# Altium project UCL-MB-802154RT-2.PrjPcb
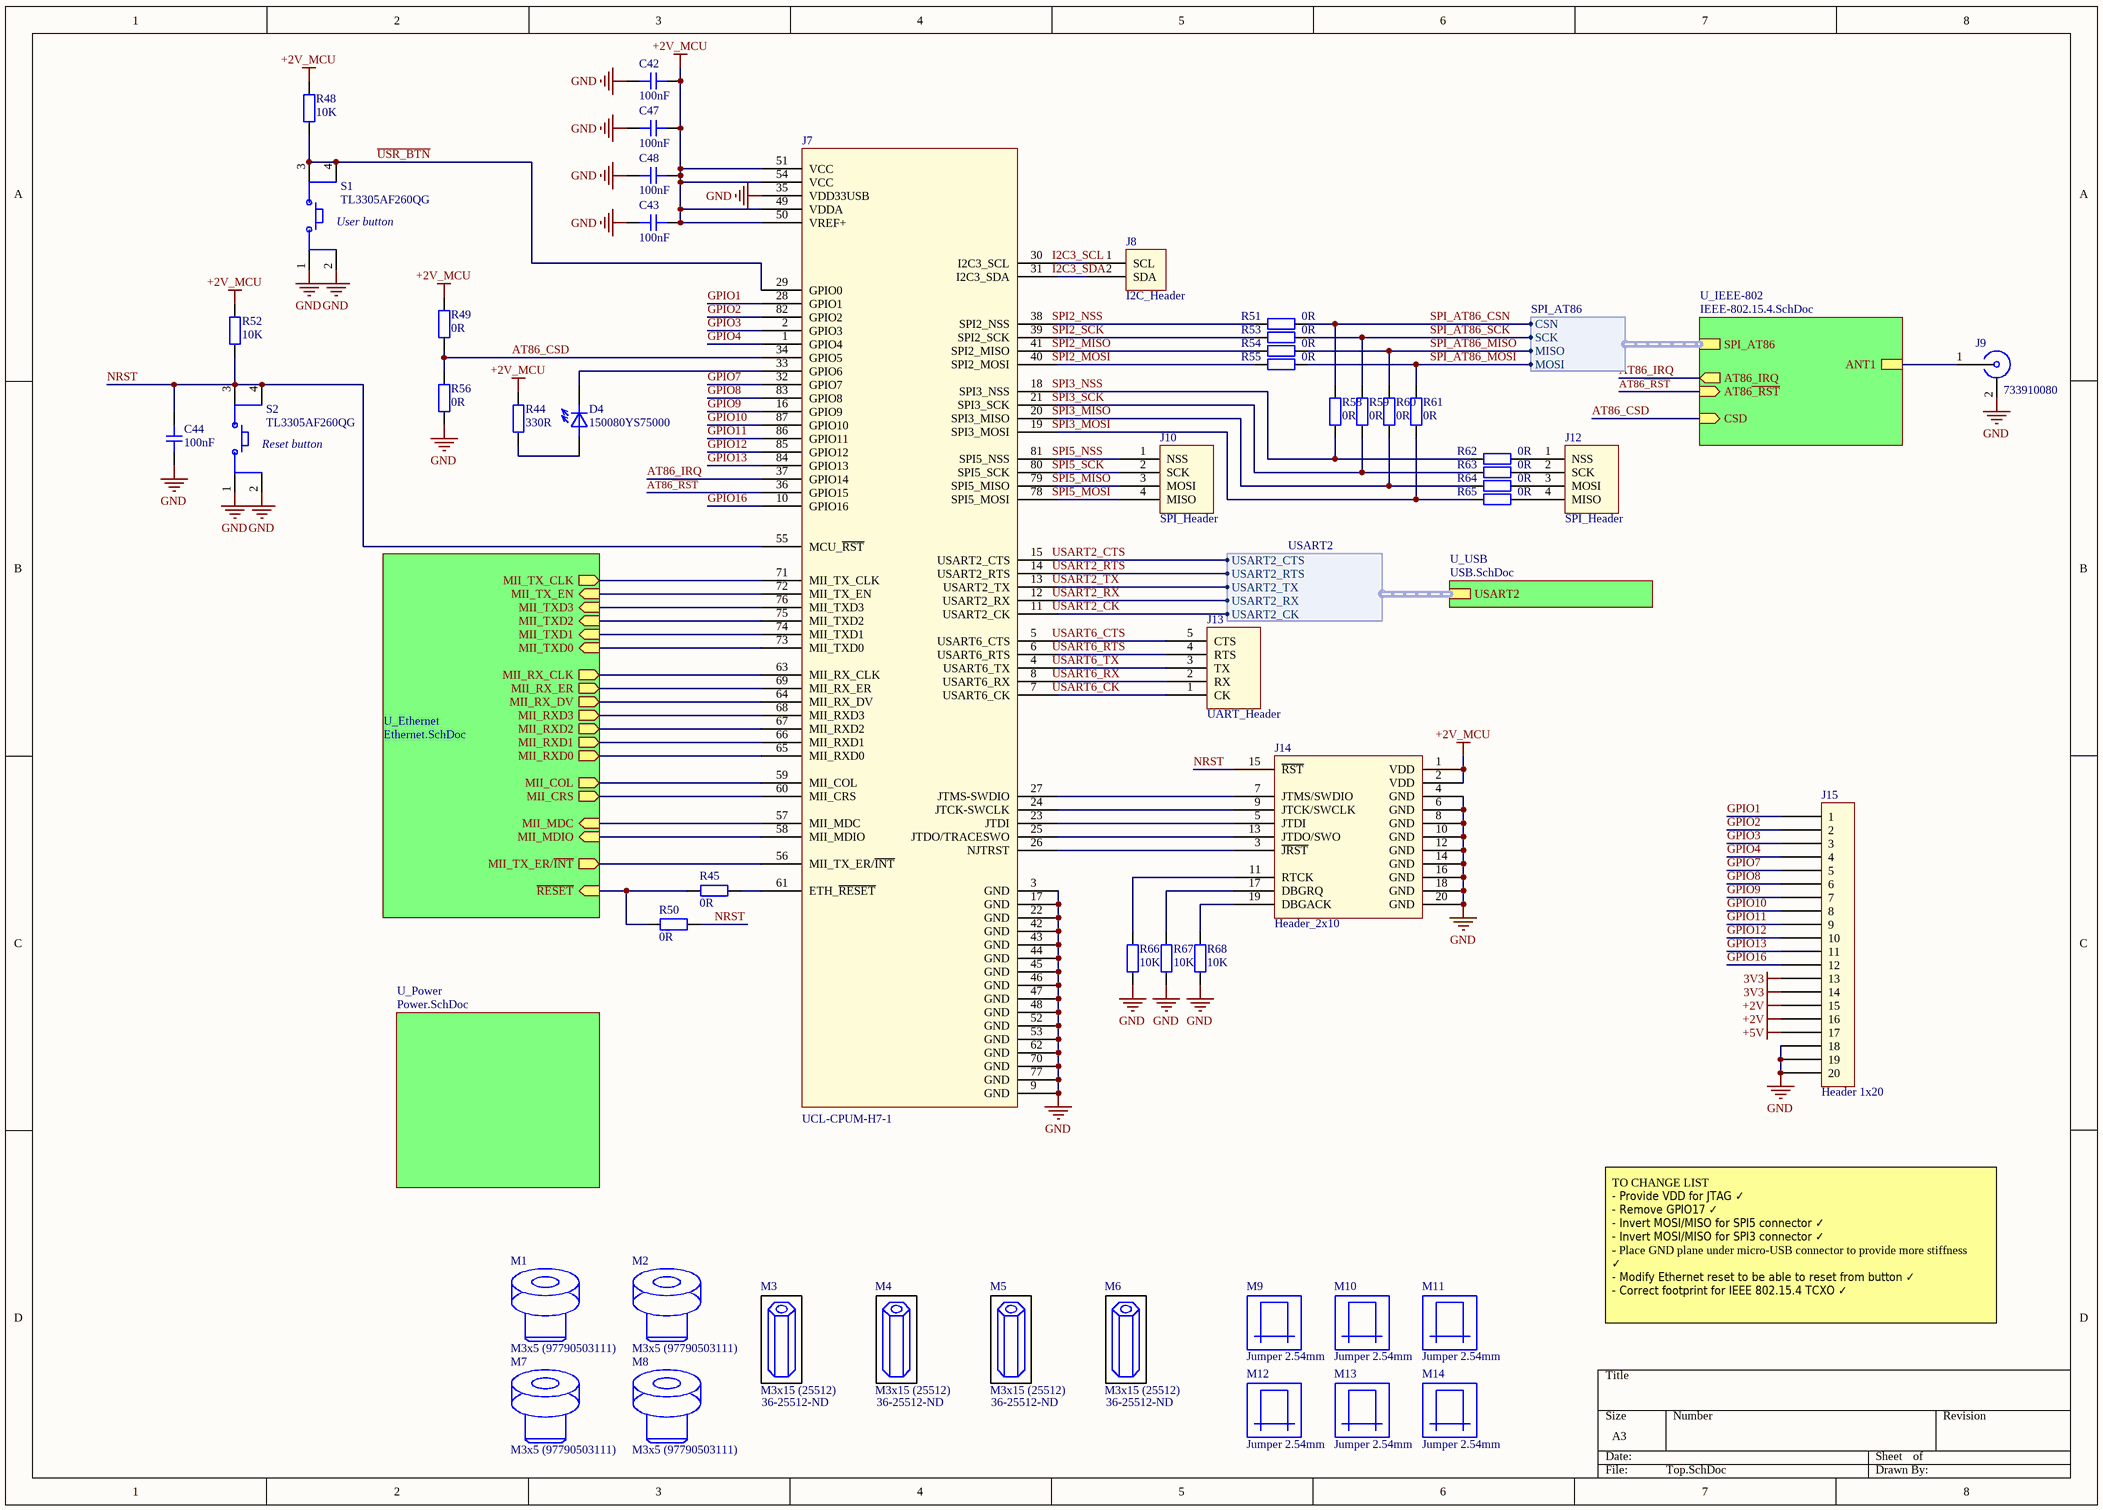
[diagram p0: Top.SchDoc]
5 sheets, 172 parts. Net scope: hierarchical (ports join the sheet entries above them; power ports are global).
Board file: UCL-MB-802154RT-2.PcbDoc
Sheets:
  Top.SchDoc
    U_Ethernet = Ethernet.SchDoc
    U_USB = USB.SchDoc
    U_Power = Power.SchDoc
    U_IEEE-802 = IEEE-802.15.4.SchDoc

## Sheet Top.SchDoc
size A3

### Parts
C42  value 100nF  [Capacitor-0603]  (hidden comment: C-100nF-0603)
C43  value 100nF  [Capacitor-0603]  (hidden comment: C-100nF-0603)
C44  value 100nF  [Capacitor-0603]  (hidden comment: C-100nF-0603)
C47  value 100nF  [Capacitor-0603]  (hidden comment: C-100nF-0603)
C48  value 100nF  [Capacitor-0603]  (hidden comment: C-100nF-0603)
D4  150080YS75000  [150080YS75000]
J7  UCL-CPUM-H7-1  [UCL-CPUM-H7-1]
J8  I2C_Header  [I2C_header]
J9  733910080  [SMA_733910080]
J10  SPI_Header  [SPI_Header]
J12  SPI_Header  [SPI_Header]
J13  UART_Header  [UART_Header]
J14  Header_2x10  [JTAG_Header]
J15  Header 1x20  [GPIO_Header]
M1  M3x5 (97790503111)  [Screw_M3]
M2  M3x5 (97790503111)  [Screw_M3]
M3  M3x15 (25512)  Supplier Part Number 1: 36-25512-ND
M4  M3x15 (25512)  Supplier Part Number 1: 36-25512-ND
M5  M3x15 (25512)  Supplier Part Number 1: 36-25512-ND
M6  M3x15 (25512)  Supplier Part Number 1: 36-25512-ND
M7  M3x5 (97790503111)  [Screw_M3]
M8  M3x5 (97790503111)  [Screw_M3]
M9  Jumper 2.54mm
M10  Jumper 2.54mm
M11  Jumper 2.54mm
M12  Jumper 2.54mm
M13  Jumper 2.54mm
M14  Jumper 2.54mm
R44  value 330R  [Resistor-0603]  (hidden comment: R-330R-0603)
R45  value 0R  [Resistor-0603]  (hidden comment: R-0R-0603)
R48  value 10K  [Resistor-0603]  (hidden comment: R-10K-0603)
R49  value 0R  [Resistor-0603]  (hidden comment: R-0R-0603)
R50  value 0R  [Resistor-0603]  (hidden comment: R-0R-0603)
R51  value 0R  [Resistor-0603]  (hidden comment: R-0R-0603)
R52  value 10K  [Resistor-0603]  (hidden comment: R-10K-0603)
R53  value 0R  [Resistor-0603]  (hidden comment: R-0R-0603)
R54  value 0R  [Resistor-0603]  (hidden comment: R-0R-0603)
R55  value 0R  [Resistor-0603]  (hidden comment: R-0R-0603)
R56  value 0R  [Resistor-0603]  (hidden comment: R-0R-0603)
R58  value 0R  [Resistor-0603]  (hidden comment: R-0R-0603)
R59  value 0R  [Resistor-0603]  (hidden comment: R-0R-0603)
R60  value 0R  [Resistor-0603]  (hidden comment: R-0R-0603)
R61  value 0R  [Resistor-0603]  (hidden comment: R-0R-0603)
R62  value 0R  [Resistor-0603]  (hidden comment: R-0R-0603)
R63  value 0R  [Resistor-0603]  (hidden comment: R-0R-0603)
R64  value 0R  [Resistor-0603]  (hidden comment: R-0R-0603)
R65  value 0R  [Resistor-0603]  (hidden comment: R-0R-0603)
R66  value 10K  [Resistor-0603]  (hidden comment: R-10K-0603)
R67  value 10K  [Resistor-0603]  (hidden comment: R-10K-0603)
R68  value 10K  [Resistor-0603]  (hidden comment: R-10K-0603)
S1  TL3305AF260QG  [TL3305AF260QG]
S2  TL3305AF260QG  [TL3305AF260QG]

### Sub-sheets
U_Ethernet = Ethernet.SchDoc: MII_RX_CLK (out), MII_RXD3 (out), MII_RXD2 (out), MII_RXD1 (out), MII_RXD0 (out), MII_RX_DV (out), MII_RX_ER (out), MII_TX_CLK (out), MII_TX_EN (in), MII_TXD0 (in), MII_TXD1 (in), MII_TXD2 (in), MII_TXD3 (in), MII_TX_ER/~{INT} (out), MII_MDIO (in), MII_MDC (in), MII_CRS (out), MII_COL (out), ~{RESET} (in)
U_IEEE-802 = IEEE-802.15.4.SchDoc: AT86_IRQ (out), AT86~{_RST} (in), SPI_AT86 (harness SPI_AT86), ANT1, CSD (in)
U_Power = Power.SchDoc: no entries
U_USB = USB.SchDoc: USART2 (harness USART2)

### Harnesses
USART2: USART2_CTS, USART2_RTS, USART2_TX, USART2_RX, USART2_CK
SPI_AT86: CSN, SCK, MISO, MOSI

### Nets
3V3: J15.13 J15.14
+2V: J15.15 J15.16
+2V_MCU: C42.2 C43.2 C47.2 C48.2 J7.49(VDDA) J7.50(VREF+) J7.51(VCC) J7.54(VCC) J14.1(VDD) J14.2(VDD) R44.2 R48.2 R49.2 R52.2
+5V: J15.17
GND: C42.1 C43.1 C44.1 C47.1 C48.1 J7.3(GND) J7.9(GND) J7.17(GND) J7.22(GND) J7.35(VDD33USB) J7.42(GND) J7.43(GND) J7.44(GND) J7.45(GND) J7.46(GND) J7.47(GND) J7.48(GND) J7.52(GND) J7.53(GND) J7.62(GND) J7.70(GND) J7.77(GND) J9.2(GND) J14.4(GND) J14.6(GND) J14.8(GND) J14.10(GND) J14.12(GND) J14.14(GND) J14.16(GND) J14.18(GND) J14.20(GND) J15.18 J15.19 J15.20 R56.1 R66.1 R67.1 R68.1 S1.1 S1.2 S2.1 S2.2
AT86~{_RST}: J7.36(GPIO15) ; sheet U_IEEE-802/AT86~{_RST}
AT86_CSD: J7.34(GPIO5) R49.1 R56.2 ; sheet U_IEEE-802/CSD
AT86_IRQ: J7.37(GPIO14) ; sheet U_IEEE-802/AT86_IRQ
ETH_MDC: J7.57(MII_MDC) ; sheet U_Ethernet/MII_MDC
ETH_MDIO: J7.58(MII_MDIO) ; sheet U_Ethernet/MII_MDIO
ETH_MII_ RX_ER: J7.69(MII_RX_ER) ; sheet U_Ethernet/MII_RX_ER
ETH_MII_COL: J7.59(MII_COL) ; sheet U_Ethernet/MII_COL
ETH_MII_CRS: J7.60(MII_CRS) ; sheet U_Ethernet/MII_CRS
ETH_MII_RX_CLK: J7.63(MII_RX_CLK) ; sheet U_Ethernet/MII_RX_CLK
ETH_MII_RX_DV: J7.64(MII_RX_DV) ; sheet U_Ethernet/MII_RX_DV
ETH_MII_RXD0: J7.65(MII_RXD0) ; sheet U_Ethernet/MII_RXD0
ETH_MII_RXD1: J7.66(MII_RXD1) ; sheet U_Ethernet/MII_RXD1
ETH_MII_RXD2: J7.67(MII_RXD2) ; sheet U_Ethernet/MII_RXD2
ETH_MII_RXD3: J7.68(MII_RXD3) ; sheet U_Ethernet/MII_RXD3
ETH_MII_TX_CLK: J7.71(MII_TX_CLK) ; sheet U_Ethernet/MII_TX_CLK
ETH_MII_TX_EN: J7.72(MII_TX_EN) ; sheet U_Ethernet/MII_TX_EN
ETH_MII_TX_ER/~{INT}: J7.56(MII_TX_ER/~{INT}) ; sheet U_Ethernet/MII_TX_ER/~{INT}
ETH_MII_TXD0: J7.73(MII_TXD0) ; sheet U_Ethernet/MII_TXD0
ETH_MII_TXD1: J7.74(MII_TXD1) ; sheet U_Ethernet/MII_TXD1
ETH_MII_TXD2: J7.75(MII_TXD2) ; sheet U_Ethernet/MII_TXD2
ETH_MII_TXD3: J7.76(MII_TXD3) ; sheet U_Ethernet/MII_TXD3
ETH_~{RESET}: R45.1 R50.1 ; sheet U_Ethernet/~{RESET}
GPIO1: J7.28(GPIO1) J15.1
GPIO2: J7.82(GPIO2) J15.2
GPIO3: J7.2(GPIO3) J15.3
GPIO4: J7.1(GPIO4) J15.4
GPIO7: J7.32(GPIO7) J15.5
GPIO8: J7.83(GPIO8) J15.6
GPIO9: J7.16(GPIO9) J15.7
GPIO10: J7.87(GPIO10) J15.8
GPIO11: J7.86(GPIO11) J15.9
GPIO12: J7.85(GPIO12) J15.10
GPIO13: J7.84(GPIO13) J15.11
GPIO16: J7.10(GPIO16) J15.12
NRST: C44.2 J7.55(MCU_~{RST}) J14.15(~{RST}) R50.2 R52.1 S2.3 S2.4
RF50_9: J9.1(SIG) ; sheet U_IEEE-802/ANT1
SPI_AT86_CSN: R51.2 R58.2 ; sheet U_IEEE-802/SPI_AT86.CSN
SPI_AT86_MISO: R54.2 R60.2 ; sheet U_IEEE-802/SPI_AT86.MISO
SPI_AT86_MOSI: R55.2 R61.2 ; sheet U_IEEE-802/SPI_AT86.MOSI
SPI_AT86_SCK: R53.2 R59.2 ; sheet U_IEEE-802/SPI_AT86.SCK
~{USR_BTN}: J7.29(GPIO0) R48.1 S1.3 S1.4
USART2_ RX: J7.12(USART2_RX) ; sheet U_USB/USART2.USART2_RX
USART2_ TX: J7.13(USART2_TX) ; sheet U_USB/USART2.USART2_TX
NetD4_1: D4.1 J7.33(GPIO6)
NetD4_2: D4.2 R44.1
NetJ7_4: J7.4(USART6_TX) J13.3(TX)
NetJ7_5: J7.5(USART6_CTS) J13.5(CTS)
NetJ7_6: J7.6(USART6_RTS) J13.4(RTS)
NetJ7_7: J7.7(USART6_CK) J13.1(CK)
NetJ7_8: J7.8(USART6_RX) J13.2(RX)
NetJ7_11: J7.11(USART2_CK) ; sheet U_USB/USART2.USART2_CK
NetJ7_14: J7.14(USART2_RTS) ; sheet U_USB/USART2.USART2_RTS
NetJ7_15: J7.15(USART2_CTS) ; sheet U_USB/USART2.USART2_CTS
NetJ7_18: J7.18(SPI3_NSS) R58.1 R62.1
NetJ7_19: J7.19(SPI3_MOSI) R61.1 R65.1
NetJ7_20: J7.20(SPI3_MISO) R60.1 R64.1
NetJ7_21: J7.21(SPI3_SCK) R59.1 R63.1
NetJ7_23: J7.23(JTDI) J14.5(JTDI)
NetJ7_24: J7.24(JTCK-SWCLK) J14.9(JTCK/SWCLK)
NetJ7_25: J7.25(JTDO/TRACESWO) J14.13(JTDO/SWO)
NetJ7_26: J7.26(NJTRST) J14.3(~{JRST})
NetJ7_27: J7.27(JTMS-SWDIO) J14.7(JTMS/SWDIO)
NetJ7_30: J7.30(I2C3_SCL) J8.1(SCL)
NetJ7_31: J7.31(I2C3_SDA) J8.2(SDA)
NetJ7_38: J7.38(SPI2_NSS) R51.1
NetJ7_39: J7.39(SPI2_SCK) R53.1
NetJ7_40: J7.40(SPI2_MOSI) R55.1
NetJ7_41: J7.41(SPI2_MISO) R54.1
NetJ7_61: J7.61(ETH_~{RESET}) R45.2
NetJ7_78: J7.78(SPI5_MOSI) J10.4(MISO)
NetJ7_79: J7.79(SPI5_MISO) J10.3(MOSI)
NetJ7_80: J7.80(SPI5_SCK) J10.2(SCK)
NetJ7_81: J7.81(SPI5_NSS) J10.1(NSS)
NetJ12_1: J12.1(NSS) R62.2
NetJ12_2: J12.2(SCK) R63.2
NetJ12_3: J12.3(MOSI) R64.2
NetJ12_4: J12.4(MISO) R65.2
NetJ14_11: J14.11(RTCK) R66.2
NetJ14_17: J14.17(DBGRQ) R67.2
NetJ14_19: J14.19(DBGACK) R68.2

### Notes on the sheet
- (near S1) User button
- (near S2) Reset button
- TO CHANGE LIST
  - Provide VDD for JTAG ✓
  - Remove GPIO17 ✓
  - Invert MOSI/MISO for SPI5 connector ✓
  - Invert MOSI/MISO for SPI3 connector ✓
  - Place GND plane under micro-USB connector to provide more stiffness ✓
  - Modify Ethernet reset to be able to reset from button ✓
  - Correct footprint for IEEE 802.15.4 TCXO ✓
- Labels drawn without touching a wire or pin: I2C3_SCL, I2C3_SDA, SPI2_MISO, SPI2_MOSI, SPI2_NSS, SPI2_SCK, SPI3_MISO, SPI3_MOSI, SPI3_NSS, SPI3_SCK, SPI5_MISO, SPI5_MOSI, SPI5_NSS, SPI5_SCK, USART2_CK, USART2_CTS, USART2_RTS, USART2_RX, USART2_TX, USART6_CK, USART6_CTS, USART6_RTS, USART6_RX, USART6_TX

### Library data of the parts
J9 = SMA_733910080: Supplier 1: Digi-Key; Supplier Part Number 1: WM4088-ND
J14 = JTAG_Header: Supplier 1: Digi-Key; Supplier Part Number 1: 2057-PH2-20-UA-ND
J15 = GPIO_Header: Supplier 1: Digi-Key; Supplier Part Number 1: S7018-ND
M1 M2 M7 M8 = Screw_M3x5: Supplier 1: Digi-Key; Supplier Part Number 1: 732-13703-ND
M3-M6 = Standoff_hex_M3_15mm_25512: Supplier 1: Digi-Key
M9-M14 = QPC02SXGN-RC: Supplier 1: Digi-Key; Supplier Part Number 1: S9337-ND
C42-C44 C47 C48 = C-100nF-0603: Supplier 1: Digi-Key; Supplier Part Number 1: 1276-1006-1-ND
D4 = 150080YS75000: Supplier 1: Digi-Key; Supplier Part Number 1: 732-4987-1-ND
J8 = I2C_Header: Supplier 1: Digi-Key; Supplier Part Number 1: SAM1222-02-ND
J10 J12 = SPI_Header: Supplier 1: Digi-Key; Supplier Part Number 1: SAM1213-04-ND
J13 = UART_Header: Supplier 1: Digi-Key; Supplier Part Number 1: SAM1213-05-ND
R44 = R-330R-0603: Supplier 1: Digi-Key; Supplier Part Number 1: 311-330HRCT-ND
R45 R49-R51 R53-R56 R58-R65 = R-0R-0603: Supplier 1: Digi-Key; Supplier Part Number 1: RMCF0603ZT0R00CT-ND
R48 R52 R66-R68 = R-10K-0603: Supplier 1: Digi-Key; Supplier Part Number 1: 311-10.0KHRCT-ND
S1 S2 = TL3305AF260QG: Supplier 1: Digi-Key; Supplier Part Number 1: EG5353CT-ND

## Sheet Ethernet.SchDoc
size A3
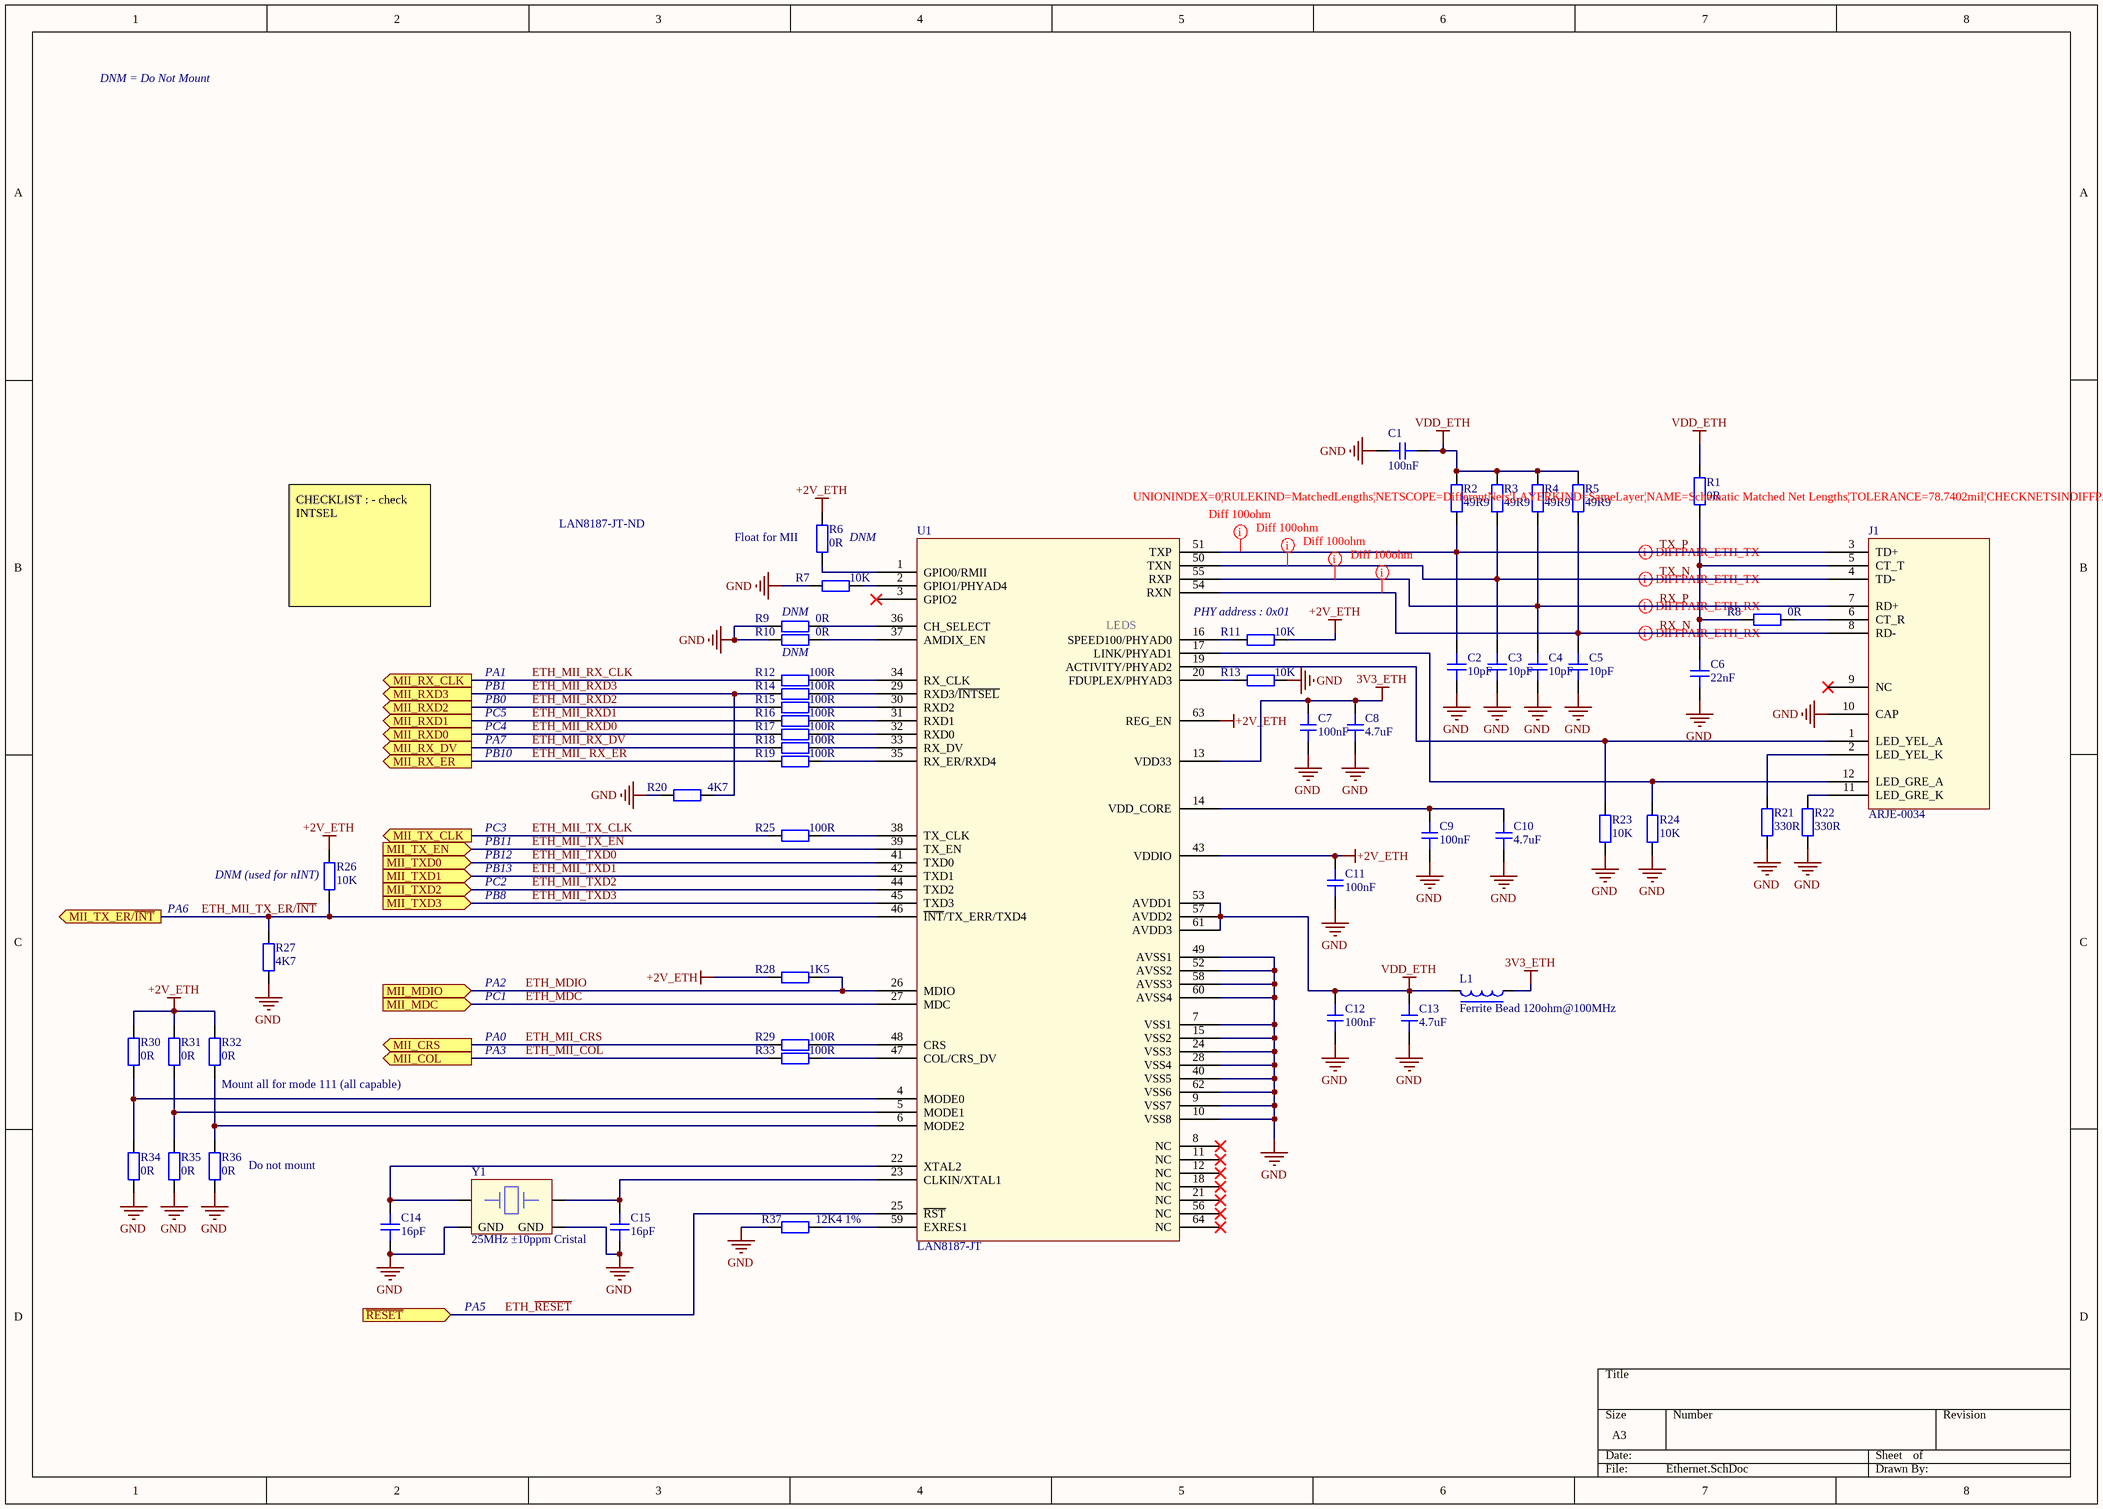
[diagram p1: Ethernet.SchDoc]

### Parts
C1  value 100nF  [Capacitor-0603]  (hidden comment: C-100nF-0603)
C2  value 10pF  [Capacitor-0603]  (hidden comment: C-10pF-0603)
C3  value 10pF  [Capacitor-0603]  (hidden comment: C-10pF-0603)
C4  value 10pF  [Capacitor-0603]  (hidden comment: C-10pF-0603)
C5  value 10pF  [Capacitor-0603]  (hidden comment: C-10pF-0603)
C6  value 22nF  [Capacitor-0603]  (hidden comment: C-22nF-0603)
C7  value 100nF  [Capacitor-0603]  (hidden comment: C-100nF-0603)
C8  value 4.7uF  [Capacitor-0603]  (hidden comment: C-4.7uF-0603)
C9  value 100nF  [Capacitor-0603]  (hidden comment: C-100nF-0603)
C10  value 4.7uF  [Capacitor-0603]  (hidden comment: C-4.7uF-0603)
C11  value 100nF  [Capacitor-0603]  (hidden comment: C-100nF-0603)
C12  value 100nF  [Capacitor-0603]  (hidden comment: C-100nF-0603)
C13  value 4.7uF  [Capacitor-0603]  (hidden comment: C-4.7uF-0603)
C14  value 16pF  [Capacitor-0603]  (hidden comment: C-16pF-0603)
C15  value 16pF  [Capacitor-0603]  (hidden comment: C-16pF-0603)
J1  ARJE-0034  [ARJE-0034]
L1  Ferrite Bead 120ohm@100MHz  [Inductor-0603]
R1  value 0R  [Resistor-0603]  (hidden comment: R-0R-0603)
R2  value 49R9  [Resistor-0603]  (hidden comment: R-49R9-0603)
R3  value 49R9  [Resistor-0603]  (hidden comment: R-49R9-0603)
R4  value 49R9  [Resistor-0603]  (hidden comment: R-49R9-0603)
R5  value 49R9  [Resistor-0603]  (hidden comment: R-49R9-0603)
R6  value 0R  [Resistor-0603]  (hidden comment: R-0R-0603)
R7  value 10K  [Resistor-0603]  (hidden comment: R-10K-0603)
R8  value 0R  [Resistor-0603]  (hidden comment: R-0R-0603)
R9  value 0R  [Resistor-0603]  (hidden comment: R-0R-0603)
R10  value 0R  [Resistor-0603]  (hidden comment: R-0R-0603)
R11  value 10K  [Resistor-0603]  (hidden comment: R-10K-0603)
R12  value 100R  [Resistor-0603]  (hidden comment: R-100R-0603)
R13  value 10K  [Resistor-0603]  (hidden comment: R-10K-0603)
R14  value 100R  [Resistor-0603]  (hidden comment: R-100R-0603)
R15  value 100R  [Resistor-0603]  (hidden comment: R-100R-0603)
R16  value 100R  [Resistor-0603]  (hidden comment: R-100R-0603)
R17  value 100R  [Resistor-0603]  (hidden comment: R-100R-0603)
R18  value 100R  [Resistor-0603]  (hidden comment: R-100R-0603)
R19  value 100R  [Resistor-0603]  (hidden comment: R-100R-0603)
R20  value 4K7  [Resistor-0603]  (hidden comment: R-4K7-0603)
R21  value 330R  [Resistor-0603]  (hidden comment: R-330R-0603)
R22  value 330R  [Resistor-0603]  (hidden comment: R-330R-0603)
R23  value 10K  [Resistor-0603]  (hidden comment: R-10K-0603)
R24  value 10K  [Resistor-0603]  (hidden comment: R-10K-0603)
R25  value 100R  [Resistor-0603]  (hidden comment: R-100R-0603)
R26  value 10K  [Resistor-0603]  (hidden comment: R-10K-0603)
R27  value 4K7  [Resistor-0603]  (hidden comment: R-4K7-0603)
R28  value 1K5  [Resistor-0603]  (hidden comment: R-1K5-0603)
R29  value 100R  [Resistor-0603]  (hidden comment: R-100R-0603)
R30  value 0R  [Resistor-0603]  (hidden comment: R-0R-0603)
R31  value 0R  [Resistor-0603]  (hidden comment: R-0R-0603)
R32  value 0R  [Resistor-0603]  (hidden comment: R-0R-0603)
R33  value 100R  [Resistor-0603]  (hidden comment: R-100R-0603)
R34  value 0R  [Resistor-0603]  (hidden comment: R-0R-0603)
R35  value 0R  [Resistor-0603]  (hidden comment: R-0R-0603)
R36  value 0R  [Resistor-0603]  (hidden comment: R-0R-0603)
R37  value 12K4 1%  [Resistor-0603]  (hidden comment: R-12K4-1%-0603)
U1  LAN8187-JT  Supplier Part Number 1: LAN8187-JT-ND  [LAN8187-JT]
Y1  25MHz ±10ppm Cristal  [830107871909]

### Ports
MII_COL (out), MII_CRS (out), MII_MDC (in), MII_MDIO (in), MII_RX_CLK (out), MII_RX_DV (out), MII_RX_ER (out), MII_RXD0 (out), MII_RXD1 (out), MII_RXD2 (out), MII_RXD3 (out), MII_TX_CLK (out), MII_TX_EN (in), MII_TX_ER/~{INT} (out), MII_TXD0 (in), MII_TXD1 (in), MII_TXD2 (in), MII_TXD3 (in), ~{RESET} (in)

### Nets
3V3_ETH: C7.2 C8.2 L1.2 U1.13(VDD33)
+2V_ETH: C11.2 R6.2 R11.2 R26.2 R28.1 R30.2 R31.2 R32.2 U1.43(VDDIO) U1.63(REG_EN)
GND: C1.1 C2.1 C3.1 C4.1 C5.1 C6.1 C7.1 C8.1 C9.1 C10.1 C11.1 C12.1 C13.1 C14.1 C15.1 J1.10(CAP) R7.1 R9.2 R10.2 R13.2 R20.1 R21.1 R22.1 R23.1 R24.1 R27.1 R34.1 R35.1 R36.1 R37.1 U1.7(VSS1) U1.9(VSS7) U1.10(VSS8) U1.15(VSS2) U1.24(VSS3) U1.28(VSS4) U1.40(VSS5) U1.49(AVSS1) U1.52(AVSS2) U1.58(AVSS3) U1.60(AVSS4) U1.62(VSS6) Y1.2(GND) Y1.4(GND)
VDD_ETH: C1.2 C12.2 C13.2 L1.1 R1.1 R2.2 R3.2 R4.2 R5.2 U1.53(AVDD1) U1.57(AVDD2) U1.61(AVDD3)
ETH_MDC: U1.27(MDC) ; port MII_MDC
ETH_MDIO: R28.2 U1.26(MDIO) ; port MII_MDIO
ETH_MII_ RX_ER: R19.1 ; port MII_RX_ER
ETH_MII_COL: R33.1 ; port MII_COL
ETH_MII_CRS: R29.1 ; port MII_CRS
ETH_MII_RX_CLK: R12.1 ; port MII_RX_CLK
ETH_MII_RX_DV: R18.1 ; port MII_RX_DV
ETH_MII_RXD0: R17.1 ; port MII_RXD0
ETH_MII_RXD1: R16.1 ; port MII_RXD1
ETH_MII_RXD2: R15.1 ; port MII_RXD2
ETH_MII_RXD3: R14.1 R20.2 ; port MII_RXD3
ETH_MII_TX_CLK: R25.1 ; port MII_TX_CLK
ETH_MII_TX_EN: U1.39(TX_EN) ; port MII_TX_EN
ETH_MII_TX_ER/~{INT}: R26.1 R27.2 U1.46(~{INT}/TX_ERR/TXD4) ; port MII_TX_ER/~{INT}
ETH_MII_TXD0: U1.41(TXD0) ; port MII_TXD0
ETH_MII_TXD1: U1.42(TXD1) ; port MII_TXD1
ETH_MII_TXD2: U1.44(TXD2) ; port MII_TXD2
ETH_MII_TXD3: U1.45(TXD3) ; port MII_TXD3
ETH_~{RESET}: U1.25(~{RST}) ; port ~{RESET}
RX_N: C5.2 J1.8(RD-) R5.1 U1.54(RXN)
RX_P: C4.2 J1.7(RD+) R4.1 U1.55(RXP)
TX_N: C3.2 J1.4(TD-) R3.1 U1.50(TXN)
TX_P: C2.2 J1.3(TD+) R2.1 U1.51(TXP)
NetC6_2: C6.2 J1.5(CT_T) R1.2 R8.2
NetC9_2: C9.2 C10.2 U1.14(VDD_CORE)
NetC14_2: C14.2 U1.22(XTAL2) Y1.1(GND)
NetC15_2: C15.2 U1.23(CLKIN/XTAL1) Y1.3(XTAL2)
NetJ1_1: J1.1(LED_YEL_A) R23.2 U1.19(ACTIVITY/PHYAD2)
NetJ1_2: J1.2(LED_YEL_K) R21.2
NetJ1_6: J1.6(CT_R) R8.1
NetJ1_11: J1.11(LED_GRE_K) R22.2
NetJ1_12: J1.12(LED_GRE_A) R24.2 U1.17(LINK/PHYAD1)
NetR6_1: R6.1 U1.1(GPIO0/RMII)
NetR7_2: R7.2 U1.2(GPIO1/PHYAD4)
NetR9_1: R9.1 U1.36(CH_SELECT)
NetR10_1: R10.1 U1.37(AMDIX_EN)
NetR11_1: R11.1 U1.16(SPEED100/PHYAD0)
NetR12_2: R12.2 U1.34(RX_CLK)
NetR13_1: R13.1 U1.20(FDUPLEX/PHYAD3)
NetR14_2: R14.2 U1.29(RXD3/~{INTSEL})
NetR15_2: R15.2 U1.30(RXD2)
NetR16_2: R16.2 U1.31(RXD1)
NetR17_2: R17.2 U1.32(RXD0)
NetR18_2: R18.2 U1.33(RX_DV)
NetR19_2: R19.2 U1.35(RX_ER/RXD4)
NetR25_2: R25.2 U1.38(TX_CLK)
NetR29_2: R29.2 U1.48(CRS)
NetR30_1: R30.1 R34.2 U1.4(MODE0)
NetR31_1: R31.1 R35.2 U1.5(MODE1)
NetR32_1: R32.1 R36.2 U1.6(MODE2)
NetR33_2: R33.2 U1.47(COL/CRS_DV)
NetR37_2: R37.2 U1.59(EXRES1)

Not connected (* = marked no-connect by the designer): J1 9(NC)*; U1 3(GPIO2)* 8(NC)* 11(NC)* 12(NC)* 18(NC)* 21(NC)* 56(NC)* 64(NC)*

### Layout directives
differential pair: RX_N, RX_P, TX_N, TX_P
rule Matched Net Lengths [Tolerance = 2mm]; rule Differential Pairs Routing [Pref Gap = 0.2mm    Min Gap  = 0.2mm    Max Gap  = 0.2mmPref Width = 0.3mm    Min Width  = 0.3mm    Max Width  = 0.3mm]: RX_N, RX_P, TX_N, TX_P

### Notes on the sheet
- DNM = Do Not Mount
- (near R6) Float for MII
- DNM
- CHECKLIST : - check INTSEL
- (near R9) DNM
- PHY address : 0x01
- PA1
- PB1
- PB0
- PC5
- (near R10) DNM
- PC4
- PA7
- PB10
- PC3
- PB11
- PB12
- PA6
- (near R26) DNM (used for nINT)
- PB13
- PC2
- PB8
- PA2
- PC1
- PA0
- PA3
- (near R32) Mount all for mode 111 (all capable)
- (near R36) Do not mount
- PA5
- (in symbol LAN8187-JT) LEDS

### Library data of the parts
L1 = PE-0603PFB121ST: Supplier 1: Digi-Key; Supplier Part Number 1: 553-2387-1-ND
Y1 = 830107871909: Supplier 1: Digi-Key; Supplier Part Number 1: 1923-830107871909CT-ND
C1 C7 C9 C11 C12 = C-100nF-0603: Supplier 1: Digi-Key; Supplier Part Number 1: 1276-1006-1-ND
C2-C5 = C-10pF-0603: Supplier 1: Digi-Key; Supplier Part Number 1: 478-1163-1-ND
C6 = C-22nF-0603: Supplier 1: Digi-Key; Supplier Part Number 1: 445-5663-1-ND
C8 C10 C13 = C-4.7uF-0603: Supplier 1: Digi-Key; Supplier Part Number 1: 490-7203-1-ND
C14 C15 = C-16pF-0603: Supplier 1: Digi-Key; Supplier Part Number 1: 1292-1490-1-ND
J1 = ARJE-0034: Supplier 1: Digi-Key; Supplier Part Number 1: 535-12443-1-ND
R1 R6 R8-R10 R30-R32 R34-R36 = R-0R-0603: Supplier 1: Digi-Key; Supplier Part Number 1: RMCF0603ZT0R00CT-ND
R2-R5 = R-49R9-0603: Supplier 1: Digi-Key; Supplier Part Number 1: RMCF0603FT49R9CT-ND
R7 R11 R13 R23 R24 R26 = R-10K-0603: Supplier 1: Digi-Key; Supplier Part Number 1: 311-10.0KHRCT-ND
R12 R14-R19 R25 R29 R33 = R-100R-0603: Supplier 1: Digi-Key; Supplier Part Number 1: 311-100HRCT-ND
R20 R27 = R-4K7-0603: Supplier 1: Digi-Key; Supplier Part Number 1: 311-4.70KHRCT-ND
R21 R22 = R-330R-0603: Supplier 1: Digi-Key; Supplier Part Number 1: 311-330HRCT-ND
R28 = R-1K5-0603: Supplier 1: Digi-Key; Supplier Part Number 1: 311-1.50KHRCT-ND
R37 = R-12K4-1%-0603: Supplier 1: Digi-Key; Supplier Part Number 1: RMCF0603FT12K4CT-ND
U1 = LAN8187-JT: Supplier 1: Digi-Key

## Sheet USB.SchDoc
size A4
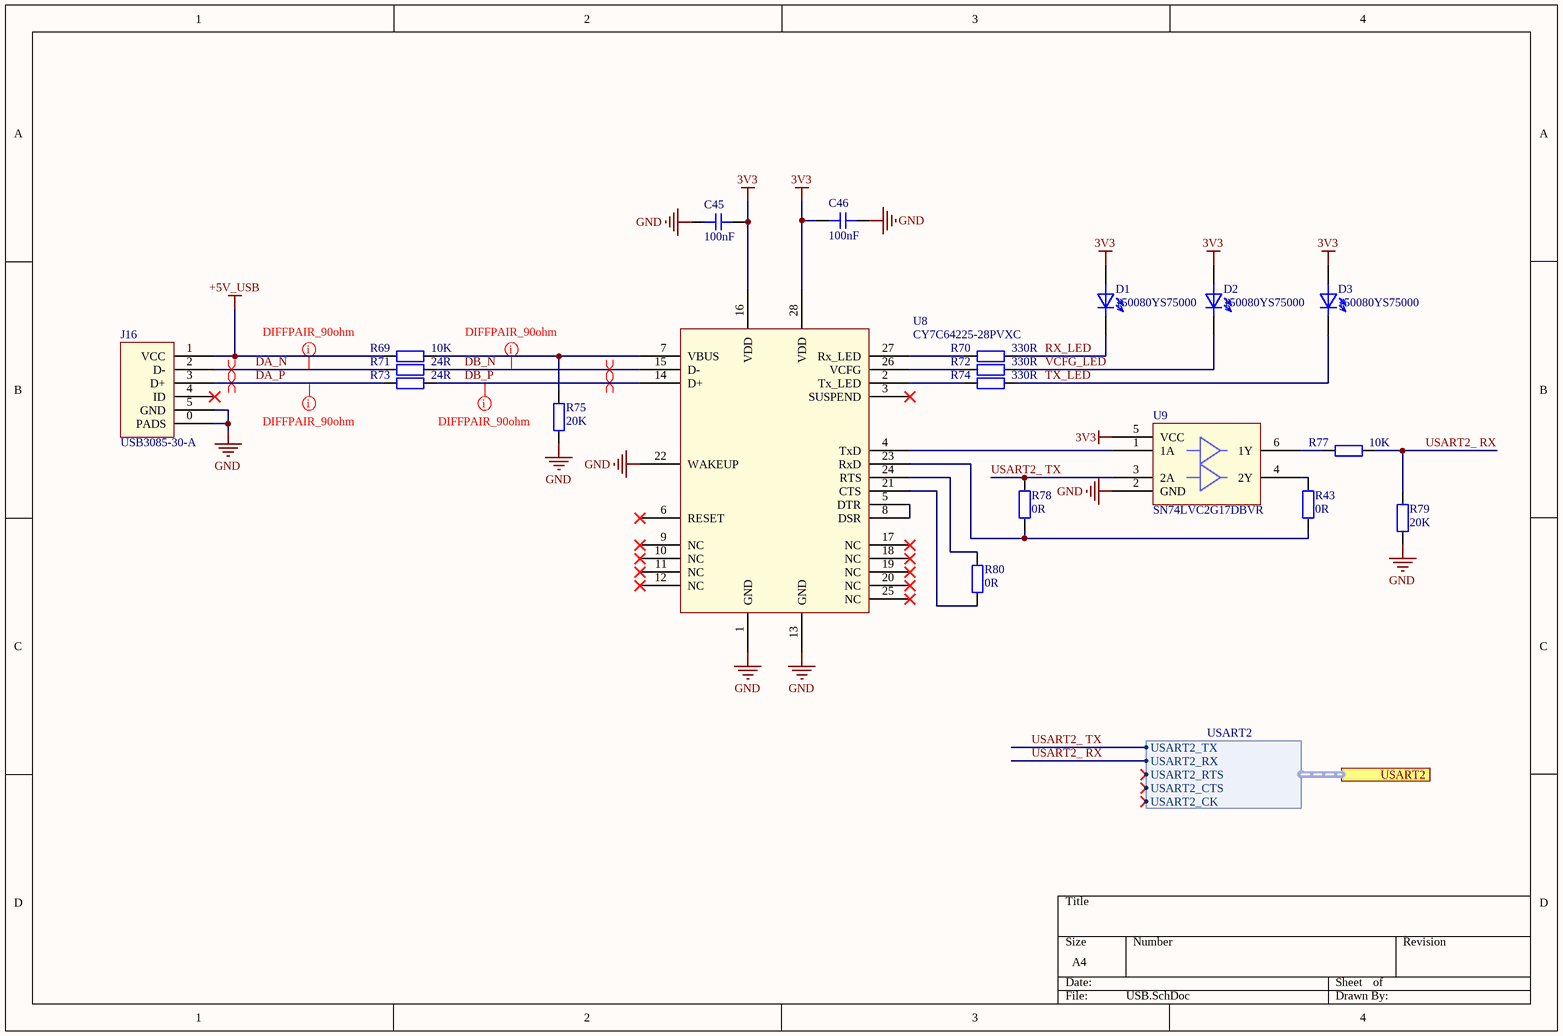
[diagram p2: USB.SchDoc]

### Parts
C45  value 100nF  [Capacitor-0603]  (hidden comment: C-100nF-0603)
C46  value 100nF  [Capacitor-0603]  (hidden comment: C-100nF-0603)
D1  150080YS75000  [150080YS75000]
D2  150080YS75000  [150080YS75000]
D3  150080YS75000  [150080YS75000]
J16  USB3085-30-A  [USB3085-30-A]
R43  value 0R  [Resistor-0603]  (hidden comment: R-0R-0603)
R69  value 10K  [Resistor-0603]  (hidden comment: R-10K-0603)
R70  value 330R  [Resistor-0603]  (hidden comment: R-330R-0603)
R71  value 24R  [Resistor-0603]  (hidden comment: R-24R-0603)
R72  value 330R  [Resistor-0603]  (hidden comment: R-330R-0603)
R73  value 24R  [Resistor-0603]  (hidden comment: R-24R-0603)
R74  value 330R  [Resistor-0603]  (hidden comment: R-330R-0603)
R75  value 20K  [Resistor-0603]  (hidden comment: R-20K-0603)
R77  value 10K  [Resistor-0603]  (hidden comment: R-10K-0603)
R78  value 0R  [Resistor-0603]  (hidden comment: R-0R-0603)
R79  value 20K  [Resistor-0603]  (hidden comment: R-20K-0603)
R80  value 0R  [Resistor-0603]  (hidden comment: R-0R-0603)
U8  CY7C64225-28PVXC  [CY7C64225-28PVXC]
U9  SN74LVC2G17DBVR  [SN74LVC2G17DBVR]

### Ports
USART2 (harness USART2)

### Harnesses
USART2: USART2_TX, USART2_RX, USART2_RTS, USART2_CTS, USART2_CK

### Nets
3V3: C45.1 C46.1 D1.2 D2.2 D3.2 U8.16(VDD) U8.28(VDD) U9.5(VCC)
+5V_USB: J16.1(VCC) R69.1
GND: C45.2 C46.2 J16.0(PADS) J16.5(GND) R75.1 R79.1 U8.1(GND) U8.13(GND) U8.22(WAKEUP) U9.2(GND)
DA_N: J16.2(D-) R71.1
DA_P: J16.3(D+) R73.1
DB_N: R71.2 U8.15(D-)
DB_P: R73.2 U8.14(D+)
RX_LED: D1.1 R70.2
TX_LED: D3.1 R74.2
USART2_ RX: R77.2 R79.2 ; port USART2.USART2_RX
USART2_ TX: R78.2 U9.3(2A) ; port USART2.USART2_TX
VCFG_LED: D2.1 R72.2
NetR43_1: R43.1 R78.1 U8.23(RxD)
NetR43_2: R43.2 U9.4(2Y)
NetR69_2: R69.2 R75.2 U8.7(VBUS)
NetR70_1: R70.1 U8.27(Rx_LED)
NetR72_1: R72.1 U8.26(VCFG)
NetR74_1: R74.1 U8.2(Tx_LED)
NetR77_1: R77.1 U9.6(1Y)
NetR80_1: R80.1 U8.21(CTS)
NetR80_2: R80.2 U8.24(RTS)
NetU8_4: U8.4(TxD) U9.1(1A)
NetU8_5: U8.5(DTR) U8.8(DSR)

Not connected (* = marked no-connect by the designer): J16 4(ID)*; U8 3(SUSPEND)* 6(RESET)* 9(NC)* 10(NC)* 11(NC)* 12(NC)* 17(NC)* 18(NC)* 19(NC)* 20(NC)* 25(NC)*

### Layout directives
differential pair: DA_N, DA_P, DB_N, DB_P
rule Differential Pairs Routing [Pref Gap = 0.2mm    Min Gap  = 0.2mm    Max Gap  = 0.2mmPref Width = 0.4mm    Min Width  = 0.4mm    Max Width  = 0.4mm]: DA_N, DA_P, DB_N, DB_P

### Library data of the parts
C45 C46 = C-100nF-0603: Supplier 1: Digi-Key; Supplier Part Number 1: 1276-1006-1-ND
D1-D3 = 150080YS75000: Supplier 1: Digi-Key; Supplier Part Number 1: 732-4987-1-ND
J16 = USB3085-30-A: Supplier 1: Digi-Key; Supplier Part Number 1: 2073-USB3085-30-ACT-ND
R43 R78 R80 = R-0R-0603: Supplier 1: Digi-Key; Supplier Part Number 1: RMCF0603ZT0R00CT-ND
R69 R77 = R-10K-0603: Supplier 1: Digi-Key; Supplier Part Number 1: 311-10.0KHRCT-ND
R70 R72 R74 = R-330R-0603: Supplier 1: Digi-Key; Supplier Part Number 1: 311-330HRCT-ND
R71 R73 = R-24R-0603: Supplier 1: Digi-Key; Supplier Part Number 1: RMCF0603FT24R0CT-ND
R75 R79 = R-20K-0603: Supplier 1: Digi-Key; Supplier Part Number 1: RMCF0603FT20K0CT-ND
U8 = CY7C64225-28PVXC: Supplier 1: Digi-Key; Supplier Part Number 1: 428-3158-ND
U9 = SN74LVC2G17DBVR: Supplier 1: Digi-Key; Supplier Part Number 1: 296-SN74LVC2G17DBVRDKR-ND

## Sheet Power.SchDoc
size A4
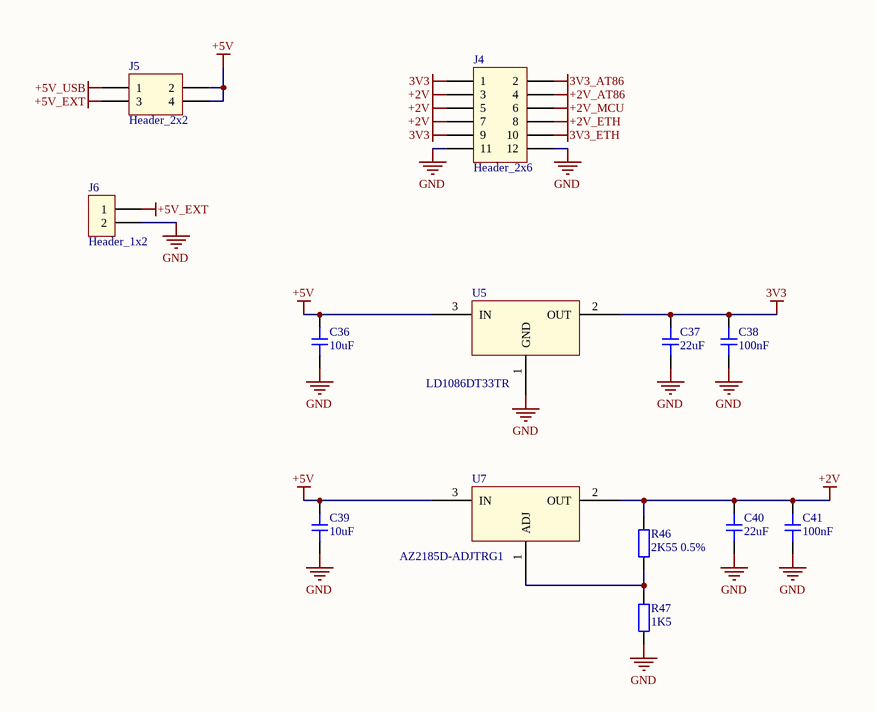
[diagram p3: Power.SchDoc]

### Parts
C36  value 10uF  [Capacitor-1210]  (hidden comment: C-10uF-1210)
C37  value 22uF  [Capacitor-1210]  (hidden comment: C-22uF-1210)
C38  value 100nF  [Capacitor-0603]  (hidden comment: C-100nF-0603)
C39  value 10uF  [Capacitor-1210]  (hidden comment: C-10uF-1210)
C40  value 22uF  [Capacitor-1210]  (hidden comment: C-22uF-1210)
C41  value 100nF  [Capacitor-0603]  (hidden comment: C-100nF-0603)
J4  Header_2x6  [Header_2x6]
J5  Header_2x2  [Header_2x2]
J6  Header_1x2  [Header_1x2]
R46  value 2K55 0.5%  [Resistor-0603]  (hidden comment: R-2K55-0603)
R47  value 1K5  [Resistor-0603]  (hidden comment: R-1K5-0603)
U5  LD1086DT33TR  [LD1086DT33TR]
U7  AZ2185D-ADJTRG1  [AZ2185D-ADJTRG1]

### Nets
3V3: C37.2 C38.2 J4.1 J4.9 U5.2(OUT)
3V3_AT86: J4.2
3V3_ETH: J4.10
+2V: C40.2 C41.2 J4.3 J4.5 J4.7 R46.2 U7.2(OUT)
+2V_AT86: J4.4
+2V_ETH: J4.8
+2V_MCU: J4.6
+5V: C36.2 C39.2 J5.2 J5.4 U5.3(IN) U7.3(IN)
+5V_EXT: J5.3 J6.1
+5V_USB: J5.1
GND: C36.1 C37.1 C38.1 C39.1 C40.1 C41.1 J4.11 J4.12 J6.2 R47.1 U5.1(GND)
NetR46_1: R46.1 R47.2 U7.1(ADJ)

### Library data of the parts
C36 C39 = C-10uF-1210: Supplier 1: Digi-Key; Supplier Part Number 1: 399-8225-1-ND
C37 C40 = C-22uF-1210: Supplier 1: Digi-Key; Supplier Part Number 1: 1276-3372-1-ND
C38 C41 = C-100nF-0603: Supplier 1: Digi-Key; Supplier Part Number 1: 1276-1006-1-ND
J4 = Header_2x6: Supplier 1: Digi-Key; Supplier Part Number 1: 2057-PH2-12-UA-ND
J5 = Header_2x2: Supplier 1: Digi-Key; Supplier Part Number 1: 2057-PH2-04-UA-ND
J6 = Header_1x2: Supplier 1: Digi-Key; Supplier Part Number 1: A19423-ND
R46 = R-2K55-0603: Supplier 1: Digi-Key; Supplier Part Number 1: 408-1735-1-ND
R47 = R-1K5-0603: Supplier 1: Digi-Key; Supplier Part Number 1: 311-1.50KHRCT-ND
U5 = LD1086DT33TR: Supplier 1: Digi-Key; Supplier Part Number 1: AZ1117IH-3.3TRG1DICT-ND
U7 = AZ2185D-ADJTRG1: Supplier 1: Digi-Key; Supplier Part Number 1: AZ2185D-ADJTRG1DICT-ND

## Sheet IEEE-802.15.4.SchDoc: TB - Module RF OFDM 869 MHz
size A3; Author: Yann Charbon; SheetNumber: 1
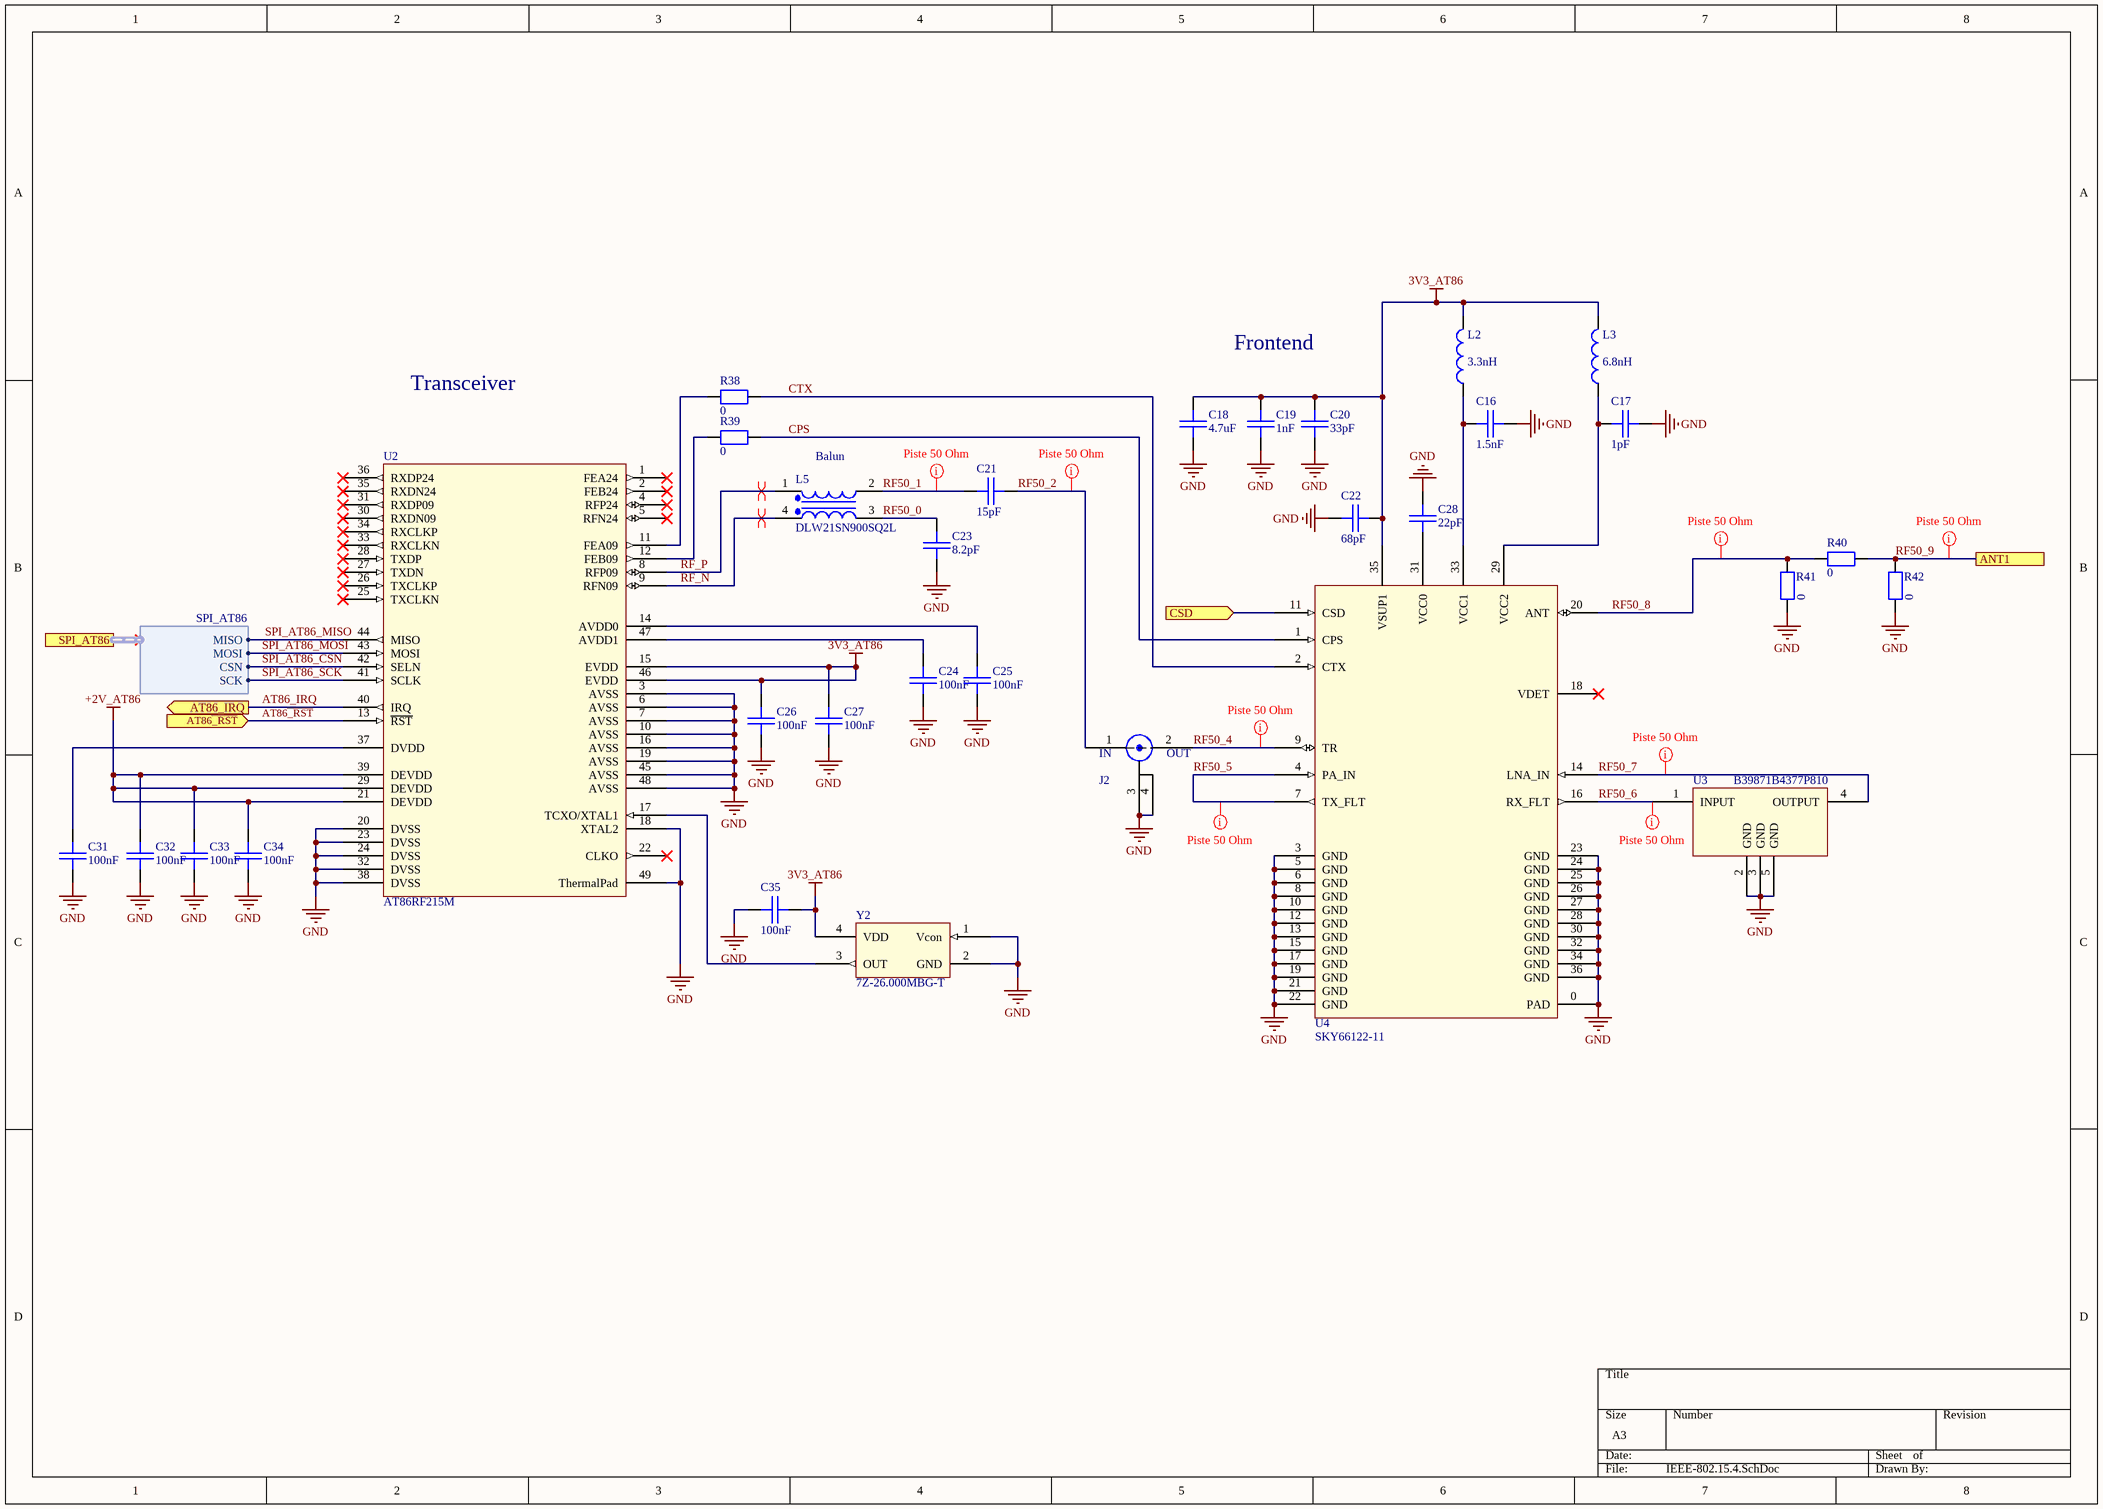
[diagram p4: IEEE-802.15.4.SchDoc]

### Parts
C16  value 1.5nF  [SM/C_0402]  (hidden comment: C-1nF-0402)
C17  value 1pF  [SM/C_0402]  (hidden comment: C-1pF-0402)
C18  value 4.7uF  [SM/C_0603]  (hidden comment: C-4.7uF-0603)
C19  value 1nF  [SM/C_0402]  (hidden comment: C-1nF-0402)
C20  value 33pF  [SM/C_0402]  (hidden comment: C-33pF-0402)
C21  value 15pF  [SM/C_0402]  (hidden comment: C-15pF-0402)
C22  value 68pF  [SM/C_0402]  (hidden comment: C-68pF-0402)
C23  value 8.2pF  [SM/C_0402]  (hidden comment: C-8.2pF-0402)
C24  value 100nF  [SM/C_0402]  (hidden comment: C-100nF-0402)
C25  value 100nF  [SM/C_0402]  (hidden comment: C-100nF-0402)
C26  value 100nF  [SM/C_0402]  (hidden comment: C-100nF-0402)
C27  value 100nF  [SM/C_0402]  (hidden comment: C-100nF-0402)
C28  value 22pF  [SM/C_0402]  (hidden comment: C-22pF-0402)
C31  value 100nF  [SM/C_0402]  (hidden comment: C-100nF-0402)
C32  value 100nF  [SM/C_0402]  (hidden comment: C-100nF-0402)
C33  value 100nF  [SM/C_0402]  (hidden comment: C-100nF-0402)
C34  value 100nF  [SM/C_0402]  (hidden comment: C-100nF-0402)
C35  value 100nF  [SM/C_0402]  (hidden comment: C-100nF-0402)
J2  MM8930-2620RJ4  [MM8030-2610RJ3]  (value not drawn)
L2  value 3.3nH  [SM/L_0402]  (hidden comment: L-3.3nH-0402)
L3  value 6.8nH  [SM/L_0603 (1608)]  (hidden comment: L-6.8nH-0603)
L5  DLW21SN900SQ2L  [MURA-DLW21SN900SQ2L-4_V]
R38  value 0  [SM/R_0402]  (hidden comment: R-0-0402)
R39  value 0  [SM/R_0402]  (hidden comment: R-0-0402)
R40  value 0  [SM/R_0402]  (hidden comment: R-0-0402)
R41  value 0  [SM/R_0402]  (hidden comment: R-0-0402)
R42  value 0  [SM/R_0402]  (hidden comment: R-0-0402)
U2  AT86RF215M  [QFN50P700X700X90-49N-D]
U3  B39871B4377P810  [B39871B4377P810]
U4  SKY66122-11  [SKY66122-11]
Y2  7Z-26.000MBG-T  [7Z-26.000MBG-T]

### Ports
ANT1, AT86_IRQ (out), AT86~{_RST} (in), CSD (in), SPI_AT86 (harness SPI_AT86)

### Harnesses
SPI_AT86: MISO, MOSI, CSN, SCK

### Nets
3V3_AT86: C18.2 C19.2 C20.2 C22.2 C26.2 C27.2 C35.1 L2.2 L3.2 U2.15(EVDD) U2.46(EVDD) U4.35(VSUP1) Y2.4(VDD)
+2V_AT86: C32.2 C33.2 C34.2 U2.21(DEVDD) U2.29(DEVDD) U2.39(DEVDD)
GND: C16.2 C17.2 C18.1 C19.1 C20.1 C22.1 C23.1 C24.1 C25.1 C26.1 C27.1 C28.2 C31.1 C32.1 C33.1 C34.1 C35.2 J2.3(GND) J2.4(GND) R41.1 R42.1 U2.3(AVSS) U2.6(AVSS) U2.7(AVSS) U2.10(AVSS) U2.16(AVSS) U2.18(XTAL2) U2.19(AVSS) U2.20(DVSS) U2.23(DVSS) U2.24(DVSS) U2.32(DVSS) U2.38(DVSS) U2.45(AVSS) U2.48(AVSS) U2.49(ThermalPad) U3.2(GND) U3.3(GND) U3.5(GND) U4.0(PAD) U4.3(GND) U4.5(GND) U4.6(GND) U4.8(GND) U4.10(GND) U4.12(GND) U4.13(GND) U4.15(GND) U4.17(GND) U4.19(GND) U4.21(GND) U4.22(GND) U4.23(GND) U4.24(GND) U4.25(GND) U4.26(GND) U4.27(GND) U4.28(GND) U4.30(GND) U4.32(GND) U4.34(GND) U4.36(GND) Y2.1(Vcon) Y2.2(GND)
AT86~{_RST}: U2.13(~{RST}) ; port AT86~{_RST}
AT86_CSD: U4.11(CSD) ; port CSD
AT86_IRQ: U2.40(IRQ) ; port AT86_IRQ
CPS: R39.2 U4.1(CPS)
CTX: R38.2 U4.2(CTX)
RF50_0: C23.2 L5.3
RF50_1: C21.1 L5.2
RF50_2: C21.2 J2.1(IN)
RF50_4: J2.2(IN) U4.9(TR)
RF50_5: U4.4(PA_IN) U4.7(TX_FLT)
RF50_6: U3.1(INPUT) U4.16(RX_FLT)
RF50_7: U3.4(OUTPUT) U4.14(LNA_IN)
RF50_8: R40.1 R41.2 U4.20(ANT)
RF50_9: R40.2 R42.2 ; port ANT1
RF_N: L5.4 U2.9(RFN09)
RF_P: L5.1 U2.8(RFP09)
SPI_AT86_CSN: U2.42(SELN) ; port SPI_AT86.CSN
SPI_AT86_MISO: U2.44(MISO) ; port SPI_AT86.MISO
SPI_AT86_MOSI: U2.43(MOSI) ; port SPI_AT86.MOSI
SPI_AT86_SCK: U2.41(SCLK) ; port SPI_AT86.SCK
NetC16_1: C16.1 L2.1 U4.33(VCC1)
NetC17_1: C17.1 L3.1 U4.29(VCC2)
NetC24_2: C24.2 U2.47(AVDD1)
NetC25_2: C25.2 U2.14(AVDD0)
NetC28_1: C28.1 U4.31(VCC0)
NetC31_2: C31.2 U2.37(DVDD)
NetR38_1: R38.1 U2.11(FEA09)
NetR39_1: R39.1 U2.12(FEB09)
NetU2_17: U2.17(TCXO/XTAL1) Y2.3(OUT)

Not connected (* = marked no-connect by the designer): U2 1(FEA24)* 2(FEB24)* 4(RFP24)* 5(RFN24)* 22(CLKO)* 25(TXCLKN)* 26(TXCLKP_)* 27(TXDN)* 28(TXDP)* 30(RXDN09)* 31(RXDP09)* 33(RXCLKN)* 34(RXCLKP)* 35(RXDN24)* 36(RXDP24)*; U4 18(VDET)*

### Layout directives
differential pair: RF_N, RF_P
rule Impedance Constraint [Min = 48.00    Max = 52.00    ]: RF50_2, RF50_4, RF50_5, RF50_6, RF50_7
mark named Piste 50 Ohm: RF50_1, RF50_8, RF50_9

### Notes on the sheet
- Frontend
- Transceiver
- (near L5) Balun
- (in symbol MM8030-2610RJ3) OUT

### Library data of the parts
C16 = C-1.5nF-0402: Supplier 1: Digi-Key; Supplier Part Number 1: 478-12618-1-ND
C18 = C-4.7uF-0603: Voltage: 6.3V; Fabricant_Ref: GRM188R60J475KE19D; Fabricant: Murata; Tolerance: 10%; Technologie: X5R; ESR: *; IRMS: *; Supplier Part Number 1b: 490-3297-6-ND; Supplier 1b: DigiReel; Supplier 1: Digi-Key; Supplier Part Number 1: 490-7203-1-ND
C19 = C-1nF-0402: Voltage: 50V; Fabricant_Ref: GRM1555C1H102FA01D; Fabricant: Murata; Tolerance: 1%; Technologie: NPO; ESR: *; IRMS: *; Supplier 1: Digi-Key; Supplier Part Number 1: 490-6189-1-ND; Supplier 2: Mouser; Supplier Part Number 2: 81-GRM1555C1H102FA1D; Supplier 1b: DigiReel; Supplier Part Number 1b: 490-6189-6-ND
C20 = C-33pF-0402: Voltage: 50V; Fabricant_Ref: C1005C0G1H330J050BA; Fabricant: TDK; Tolerance: 5%; Technologie: NPO; ESR: *; IRMS: *; Supplier 1: Digi-Key; Supplier Part Number 1: 445-1241-1-ND; Supplier 1b: DigiReel; Supplier 2: Mouser; Supplier Part Number 1b: 445-1241-6-ND; Supplier Part Number 2: 810-C1005C0G1H330J
C21 = C-15pF-0402: Voltage: 6.3V; Fabricant_Ref: GRM188R60J475KE19D; Fabricant: Murata; Tolerance: 10%; Technologie: X5R; ESR: *; IRMS: *; Supplier Part Number 1b: 490-3297-6-ND; Supplier 1b: DigiReel; Supplier 1: Digi-Key; Supplier Part Number 1: 490-11191-1-ND
C22 = C-68pF-0402: Voltage: 50V; Fabricant_Ref: C1005C0G1H330J050BA; Fabricant: TDK; Tolerance: 5%; Technologie: NPO; ESR: *; IRMS: *; Supplier 1b: DigiReel; Supplier Part Number 1b: 445-1241-6-ND; Supplier 1: Digi-Key; Supplier Part Number 1: 478-1080-1-ND
C23 = C-8.2pF-0402: Voltage: 6.3V; Fabricant_Ref: GRM188R60J475KE19D; Fabricant: Murata; Tolerance: 10%; Technologie: X5R; ESR: *; IRMS: *; Supplier Part Number 1b: 490-3297-6-ND; Supplier 1b: DigiReel; Supplier 1: Digi-Key; Supplier Part Number 1: 490-11240-1-ND
C24-C27 C31-C35 = C-100nF-0402: Voltage: 25V; Fabricant_Ref: GRM155R71H103KA88J; Fabricant: Murata; Tolerance: 10%; Technologie: X7R; ESR: *; IRMS: *; Supplier 1: Digi-Key; Supplier Part Number 1: 1276-6720-1-ND; Supplier 2: Mouser; Supplier Part Number 2: 710-885012205037
C28 = C-22pF-0402: Voltage: 50V; Fabricant_Ref: GRM1555C1H220FA01D; Fabricant: Murata; Tolerance: 1%; Technologie: NPO; ESR: *; IRMS: *; Supplier 1: Digi-Key; Supplier Part Number 1: 490-8589-1-ND; Supplier 2: Mouser; Supplier Part Number 2: 81-GRM1555C1H220FA1D
J2 = MM8030-2610RJ3: SWG Connecteur Socle, prise femelle 50Ohms; RoHS: No; Supplier 1: Digi-Key; Supplier Part Number 1: 490-5907-1-ND
L2 = L-3.3nH-0402: I_DC: 300mA; Tolerance: 0.3nH; Fabricant: Murata; Fabricant_Ref: LQG15HN3N3S02D; Supplier 1: Digi-Key; Supplier Part Number 1: 490-6561-1-ND; Supplier 1b: DigiReel; Supplier 2: Mouser; Supplier Part Number 1b: 490-6561-6-ND; Supplier Part Number 2: 81-LQG15HN3N0S02D
L3 = L-6.8nH-0603: I_DC: 300mA; Tolerance: 5%; Fabricant: Murata; Fabricant_Ref: LQG18HN6N8J00D; Supplier 1: Digi-Key; Supplier Part Number 1: 490-1108-1-ND; Supplier 1b: DigiReel; Supplier 2: Mouser; Supplier Part Number 1b: 490-1108-6-ND; Supplier Part Number 2: 81-LQG18HN6N8J00D
L5 = DLW21SN900SQ2L: Chip Common Mode Choke Coil, 90 Ohm, 330 mA, -40 to 85 degC, 4-Pin SMD, RoHS, Tape and Reel; Manufacturer: Murata; DC Resistance-Max: 0.41O; Impedance: 90O; Rated Voltage: 50V; Rated Current: 280mA; Manufacturer URL: http://www.murata.com/; Case Size/Dimension: 0805; Datasheet URL: http://www.murata.com/zh-cn/products/productdata/8796757917726/EFLC0003.pdf?1441769419000; Datasheet Version: Aug-14; Supplier 1: Digi-Key; Supplier Part Number 1: 490-5137-1-ND
R38-R42 = R-0-0402: Fabricant_Ref: ERJ-2GE0R00X; Fabricant: Panasonic; Puissance: 100 mW; Tolerance: 1%; Tension: 50V; Supplier 1: Digi-Key; Supplier Part Number 1: P0.0JCT-ND; Supplier 1b: DigiReel; Supplier 2: Mouser; Supplier Part Number 1b: P0.0JDKR-ND; Supplier Part Number 2: 667-ERJ-2GE0R00X
U2 = AT86RF215M: IC RF TXRX 802.15.4/ISM 48-VFQFN; Supplier 1: Digi-Key; Supplier Part Number 1: AT86RF215M-ZU-ND
Y2 = 7Z-26.000MBG-T: XTAL OSC TCXO 26.0000MHZ SNWV; Frequency Stability: 1ppm; Frequency: 26MHz; Max Supply Current: 2mA; Supplier 1: Digi-Key; RoHS: Yes; Mount: Surface Mount; Case/Package: SMD/SMT; Min Operating Temperature: -40°C; Max Operating Temperature: 85°C; Packaging: Tape and Reel; Length: 0.126inch; Height: 0.039inch; Width: 0.098inch; ComponentLink1URL: http://www.taitien.com/wp-content/uploads/2015/12/XO-0076_TX.pdf?src-supplier=Digi-Key; ComponentLink1Description: http://www.taitien.com/wp-content/uploads/2015/12/XO-0076_TX.pdf?src-supplier=Digi-Key; Supplier Part Number 1: 887-1620-1-ND
C17 = C-1pF-0402: Supplier 1: Digi-Key; Supplier Part Number 1: 1276-1595-1-ND
U3 = B39871B4377P810: Supplier 1: Mouser; Supplier Part Number 1: 871-B39871B4377P810
U4 = SKY66122-11: Supplier 1: Digi-Key; Supplier Part Number 1: 863-SKY66122-11CT-ND

## Nets that join several sheets
3V3: Top (J15.13 J15.14), USB (8 pins), Power (5 pins)
3V3_AT86: Power (J4.2), IEEE-802.15.4 (13 pins)
3V3_ETH: Ethernet (C7.2 C8.2 L1.2 U1.13), Power (J4.10)
+2V: Top (J15.15 J15.16), Power (7 pins)
+2V_AT86: Power (J4.4), IEEE-802.15.4 (6 pins)
+2V_ETH: Ethernet (10 pins), Power (J4.8)
+2V_MCU: Top (14 pins), Power (J4.6)
+5V: Top (J15.17), Power (6 pins)
+5V_USB: USB (J16.1 R69.1), Power (J5.1)
GND: Top (43 pins), Ethernet (44 pins), USB (10 pins), Power (11 pins), IEEE-802.15.4 (64 pins)
AT86~{_RST}: Top (J7.36), IEEE-802.15.4 (U2.13)
AT86_CSD: Top (J7.34 R49.1 R56.2), IEEE-802.15.4 (U4.11)
AT86_IRQ: Top (J7.37), IEEE-802.15.4 (U2.40)
ETH_MDC: Top (J7.57), Ethernet (U1.27)
ETH_MDIO: Top (J7.58), Ethernet (R28.2 U1.26)
ETH_MII_ RX_ER: Top (J7.69), Ethernet (R19.1)
ETH_MII_COL: Top (J7.59), Ethernet (R33.1)
ETH_MII_CRS: Top (J7.60), Ethernet (R29.1)
ETH_MII_RX_CLK: Top (J7.63), Ethernet (R12.1)
ETH_MII_RX_DV: Top (J7.64), Ethernet (R18.1)
ETH_MII_RXD0: Top (J7.65), Ethernet (R17.1)
ETH_MII_RXD1: Top (J7.66), Ethernet (R16.1)
ETH_MII_RXD2: Top (J7.67), Ethernet (R15.1)
ETH_MII_RXD3: Top (J7.68), Ethernet (R14.1 R20.2)
ETH_MII_TX_CLK: Top (J7.71), Ethernet (R25.1)
ETH_MII_TX_EN: Top (J7.72), Ethernet (U1.39)
ETH_MII_TX_ER/~{INT}: Top (J7.56), Ethernet (R26.1 R27.2 U1.46)
ETH_MII_TXD0: Top (J7.73), Ethernet (U1.41)
ETH_MII_TXD1: Top (J7.74), Ethernet (U1.42)
ETH_MII_TXD2: Top (J7.75), Ethernet (U1.44)
ETH_MII_TXD3: Top (J7.76), Ethernet (U1.45)
ETH_~{RESET}: Top (R45.1 R50.1), Ethernet (U1.25)
RF50_9: Top (J9.1), IEEE-802.15.4 (R40.2 R42.2)
SPI_AT86_CSN: Top (R51.2 R58.2), IEEE-802.15.4 (U2.42)
SPI_AT86_MISO: Top (R54.2 R60.2), IEEE-802.15.4 (U2.44)
SPI_AT86_MOSI: Top (R55.2 R61.2), IEEE-802.15.4 (U2.43)
SPI_AT86_SCK: Top (R53.2 R59.2), IEEE-802.15.4 (U2.41)
USART2_ RX: Top (J7.12), USB (R77.2 R79.2)
USART2_ TX: Top (J7.13), USB (R78.2 U9.3)

## Assembly variants
R 0ohm not fitted: not fitted R6 R9 R10 R26 R34 R35 R36 R41 R42 R45 R56 R58 R59 R60 R61 R78